# Altium schematic sheet Power management.SchDoc
size A; SheetNumber: 3; SheetTotal: 8
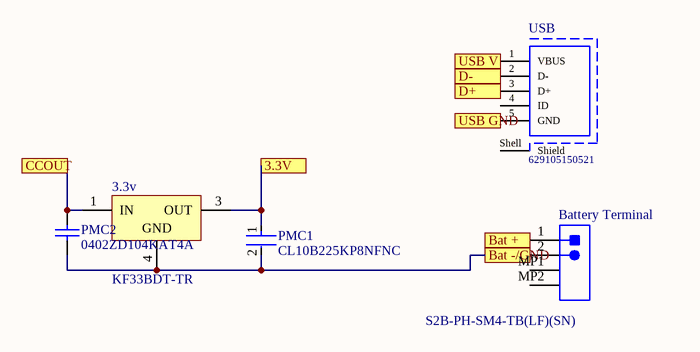
[diagram p0: Power management.SchDoc]

## Parts
3.3v  KF33BDT-TR  [TO-252_L]
Battery_Terminal  S2B-PH-SM4-TB(LF)(SN)  [JST- S2B-PH-SM4-TB(LF)(SN)-2_V]
PMC1  CL10B225KP8NFNC  [FP-CL10-IPC_A]
PMC2  0402ZD104KAT4A  [CAPC1005X56X25ML10T15]
USB  629105150521  [629105150521]

## Ports
3.3V, Bat +, Bat -/GND, CCOUT, D+, D-, USB GND, USB V

## Nets
3.3V: 3.3v.3(OUT) PMC1.1 ; port 3.3V
Bat +: Battery_Terminal.1 ; port Bat +
Bat -/GND: 3.3v.4(GND) Battery_Terminal.2 PMC1.2 PMC2.1 ; port Bat -/GND
CCOUT: 3.3v.1(IN) PMC2.2 ; port CCOUT
D+: USB.3(D+) ; port D+
D-: USB.2(D-) ; port D-
USB GND: USB.5(GND) ; port USB GND
USB V: USB.1(VBUS) ; port USB V

Not connected (* = marked no-connect by the designer): Battery_Terminal MP1 MP2; USB 4(ID) Shell(Shield)

## Library data of the parts
3.3v = CMP-0244-00072-1: Very Low Drop Voltage Regulators with Inhibit, 3.3V, 3-Pin DPAK, Tape and Reel; DatasheetVersion: 21/02/2008; ComponentLink2Description: Datasheet; ComponentLink1URL: http://www.st.com; PackageVersion: 2011; ComponentLink1Description: Manufacturer URL; PackageDescription: 3-Pin Transistor Outline Package 2.28 mm Pitch, 9.7 mm Lead Span (DPAK); ComponentLink2URL: http://www.st.com/internet/com/TECHNICAL_RESOURCES/TECHNICAL_LITERATURE/DATASHEET/CD00000970.pdf; PackageReference: TO-252
Battery_Terminal = CMP-1755-00001-1: Male Header, Pitch 2 mm, 1 x 2 Position, Height 5.5 mm, -25 to 85 degC, RoHS, Tape and Reel; Current Rating: 3 A; ComponentLink1URL: http://www.jst.com/home2.html; Radiation Hardening: No; RoHSCompliant: True; Mount: Through Hole; Contact Material: Bronze; Package Quantity: 100; Width: 2.34 mm; DatasheetVersion: Dec-12; Height: 8.13 mm; Max Operating Temperature: 105degC; ComponentLink2Description: Datasheet; Lead Pitch: 0.1 inch; Contact Finish: Lead; Packaging: Bulk; Colour: Black; Contact Plating: Tin; Min Operating Temperature: -65degC; ComponentLink1Description: Manufacturer URL; PackageReference: S2B-PH-SM4-TB(LF)(SN)-2; PackageDescription: Male Header, Pitch 2 mm, 1 x 2 Position, Height 5.5 mm; ComponentLink2URL: http://www.jst-mfg.com/product/pdf/eng/ePH.pdf; Pins: 40; Length: 101.19 mm
PMC1 = CMP-13271-000561-1: Cap Ceramic 2.2uF 10V X7R ±10% Pad SMD 0603 +125°C T/R; Thickness: 0.035inch; Radiation Hardening: No; Voltage Rating: 10V; Min Operating Temperature: -55°C; Case Code (Imperial): 0603; Mount: Surface Mount; Dielectric: X7R; Case Code (Metric): 1608; Package Quantity: 1; Width: 0.031inch; Case/Package: 0603; Height: 0.8mm; Depth: 0.8mm; Capacitance: 2.2uF; Max Operating Temperature: 125°C; Packaging: Tape and Reel; Length: 0.063inch; Tolerance: 10%
PMC2 = CMP-2008-02879-1: Manufacturer: AVX Interconnect / Elco; Part Number: 0402ZD104KAT4A
USB = CMP-1502-03252-1: Micro USB 2.0 Type B Receptacle WR-COM, Horizontal, SMT, with Pegs, High Current at Pin 1 & Pin 5; Manufacturer: Wurth Elektronik; Contact Resistance: 30mOhm; Rated Current: 3A; Working Voltage: 30VAC; Package Reference: 629105150521; Mounting Technology: SMT; Connector Type: MicroUSB2.0TypeB; Operating Temperature: -40to85degC; Orientation: Horizontal; Manufacturer URL: http://www.we-online.de; Datasheet URL: https://katalog.we-online.de/em/datasheet/629105150521.pdf; Part Number: 629105150521; Packaging: TapeandReel; Gender: Receptacle; Publisher: WurthElektronik